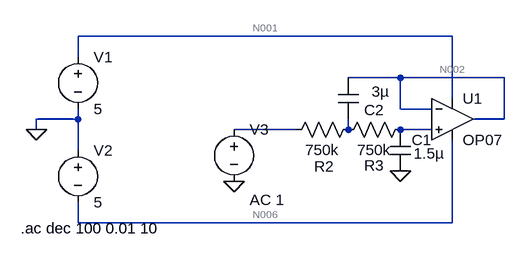
[diagram p0: schematic Draft2.asc]
Draft2.asc, the LTspice schematic file:
Version 4
SHEET 1 880 680
WIRE 176 32 -400 32
WIRE -400 64 -400 32
WIRE 96 96 16 96
WIRE 256 96 96 96
WIRE 176 128 176 32
WIRE 96 144 96 96
WIRE 144 144 96 144
WIRE -400 160 -400 144
WIRE -400 160 -464 160
WIRE 256 160 256 96
WIRE 256 160 208 160
WIRE -464 176 -464 160
WIRE -64 176 -160 176
WIRE 16 176 16 160
WIRE 144 176 96 176
WIRE -400 208 -400 160
WIRE -400 320 -400 288
WIRE 176 320 176 192
WIRE 176 320 -400 320
FLAG -464 176 0
FLAG 96 240 0
FLAG -160 256 0
SYMBOL Opamps\\OP07 176 96 R0
SYMATTR InstName U1
SYMBOL voltage -400 48 R0
WINDOW 123 0 0 Left 2
WINDOW 39 0 0 Left 2
SYMATTR InstName V1
SYMATTR Value 5
SYMBOL voltage -400 192 R0
WINDOW 123 0 0 Left 2
WINDOW 39 0 0 Left 2
SYMATTR InstName V2
SYMATTR Value 5
SYMBOL res 32 160 R90
WINDOW 0 88 53 VBottom 2
WINDOW 3 32 56 VTop 2
SYMATTR InstName R2
SYMATTR Value 750k
SYMBOL cap 112 240 R180
WINDOW 0 -32 48 Left 2
WINDOW 3 -52 27 Left 2
SYMATTR InstName C1
SYMATTR Value 1.5µ
SYMBOL cap 32 160 R180
WINDOW 0 -39 14 Left 2
WINDOW 3 -47 43 Left 2
SYMATTR InstName C2
SYMATTR Value 3µ
SYMBOL res 112 160 R90
WINDOW 0 87 56 VBottom 2
WINDOW 3 32 56 VTop 2
SYMATTR InstName R3
SYMATTR Value 750k
SYMBOL voltage -160 160 R0
WINDOW 123 24 124 Left 2
WINDOW 39 0 0 Left 2
SYMATTR InstName V3
SYMATTR Value ""
SYMATTR Value2 AC 1
TEXT -488 328 Left 2 !.ac dec 100 0.01 10

The netlist it stands for:
* Draft2.asc
XU1 N005 N002 N001 N006 N002 LT1001  ; OP07, pins In+ In- V+ V- OUT
V1 N001 0 5
V2 0 N006 5
R2 N004 N003 750k
C1 0 N005 1.5µ
C2 N004 N002 3µ
R3 N005 N004 750k
V3 N003 0 AC 1
.ac dec 100 0.01 10
.lib LTC.lib
.backanno
.end

* Results of the author's LTspice run, read from the files saved beside the schematic
* Operating Point, zero values left out:
*   V(n001) = 5 V
*   V(n006) = -5 V
*   I(V2) = -2.25 mA
*   I(V1) = -2.25 mA
*   Ix(u1:3) = 2.25 mA
*   Ix(u1:4) = -2.25 mA
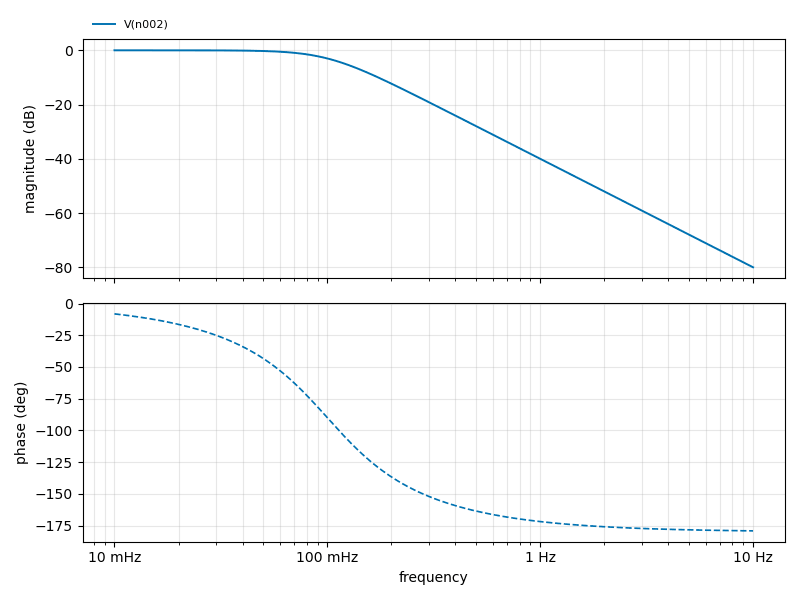
[diagram p1: AC Analysis of Draft2.asc, plotted from the saved traces]
* AC Analysis, 1 run:
*   V(n002): -0.00 dB at 10 mHz, -79.99 dB at 10 Hz, peak -0.00 dB at 10 mHz, 3 dB below the peak at 100 mHz